# Altium schematic sheet USB.SchDoc
size A4; DocumentNumber: 3; SheetNumber: 3; SheetTotal: 8
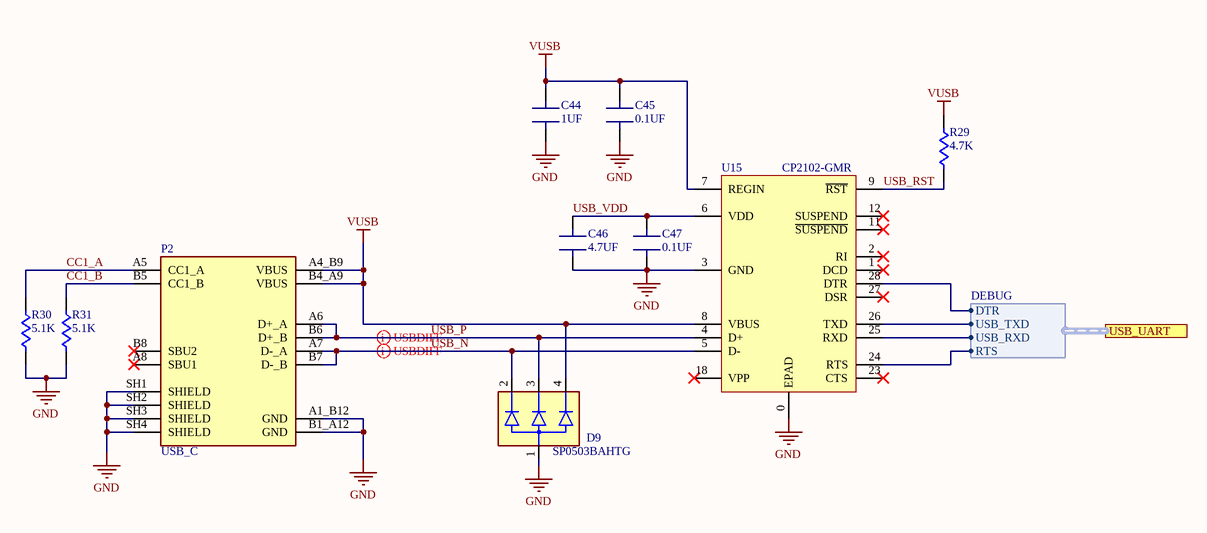
[diagram p0: USB.SchDoc]

## Parts
C44  1UF  [CAP: 0603]
C45  0.1UF  [CAP: 0603]
C46  4.7UF  [CAP: 0805]
C47  0.1UF  [CAP: 0603]
D9  SP0503BAHTG  [SOT143-4]
P2  USB_C  [AMPHENOL_12402012E212A]
R29  4.7K  [RES: 0603]
R30  5.1K  [RES: 0603]
R31  5.1K  [RES: 0603]
U15  CP2102-GMR  [28-QFN (5x5)]

## Ports
USB_UART (harness DEBUG)

## Harnesses
DEBUG: DTR, USB_TXD, USB_RXD, RTS

## Nets
GND: C44.1(A) C45.1(A) C46.1(A) C47.1(A) D9.1 P2.A1_B12(GND) P2.B1_A12(GND) P2.SH1(SHIELD) P2.SH2(SHIELD) P2.SH3(SHIELD) P2.SH4(SHIELD) R30.1 R31.1 U15.0(EPAD) U15.3(GND)
VUSB: C44.2(B) C45.2(B) D9.4 P2.A4_B9(VBUS) P2.B4_A9(VBUS) R29.2 U15.7(REGIN) U15.8(VBUS)
CC1_A: P2.A5(CC1_A) R30.2
CC1_B: P2.B5(CC1_B) R31.2
USB_N: D9.2 P2.A7(D-_A) P2.B7(D-_B) U15.5(D-)
USB_P: D9.3 P2.A6(D+_A) P2.B6(D+_B) U15.4(D+)
USB_RST: R29.1 U15.9(~{RST})
USB_VDD: C46.2(B) C47.2(B) U15.6(VDD)
NetU15_24: U15.24(RTS) ; port USB_UART.RTS
NetU15_25: U15.25(RXD) ; port USB_UART.USB_RXD
NetU15_26: U15.26(TXD) ; port USB_UART.USB_TXD
NetU15_28: U15.28(DTR) ; port USB_UART.DTR

Not connected (* = marked no-connect by the designer): P2 A8(SBU1)* B8(SBU2)*; U15 1(DCD)* 2(RI)* 11(~{SUSPEND})* 12(SUSPEND)* 18(VPP)* 23(CTS)* 27(DSR)*

## Layout directives
differential pair; net class USBDIFF: USB_N, USB_P

## Notes on the sheet
- Size:
- Date:
- Sheet Name:
- A4
- Sheet
- Time:
- of
- Author :
- Hatim Saad
- Project:
- File:

## Library data of the parts
C44 C45 C47 = CAP 0603: CAP SMD 0603
C46 = CAP 0805: CAP SMD 0805
D9 = SP0503BAHTG: SP050xBA Series 8.5 V 30 pF Triple Uni-Directional TVS Avalanche Diode-SOT143-4; Manufacturer: Littelfuse; Operating Supply Voltage: 5.5V; Direction: Unidirectional; Value: 30pF; Number of Channels: 3; Clamping Voltage: 7.8V; Power Line Protection: No; Polarity: Bidirectional,Unidirectional; Max Power Dissipation: 225mW; ESD Protection: Yes; Max Reverse Leakage Current: 100nA; Voltage Rating (DC): 5V; Clamping Voltage-Max: 8V; Supplier: Future Electronics; Supplier Part Number: 4171229; Manufacturer Part Number: SP0503BAHTG; RoHS: Yes; Category: TVS Diodes; Stock: 3237; Pricing: 1=0.85, 15=0.75, 75=0.69, 300=0.64, 1500=0.585 (USD); Mounting Technology: Surface Mount; Case/Package: SOT-143; Pins: 4; Min Operating Temperature: -40°C; Max Operating Temperature: 85°C; Packaging: Tape and Reel; Number of Unidirectional Channels: 3; Reverse Standoff Voltage: 5.5V; Breakdown Voltage: 5.5V; Termination: SMD/SMT; Working Voltage: 5.5V; Peak Pulse Power: 225mW; Leakage Current: 100nA; Number of Elements: 3; Power Dissipation: 225mW; Diode Type: Avalanche; Series: SP05, SPA®; Length: 3.04mm; Width: 1.4mm; Height: 1.05mm; Depth: 1.4mm; Radiation Hardening: No; Reach SVHC Compliant: No; Lead Free: Lead Free; RoHS Compliant: Yes; ComponentLink1URL: https://datasheet.ciiva.com/15143/getdatasheetpartid-116020-15143550.pdf?src-supplier=Verical; ComponentLink1Description: https://datasheet.ciiva.com/15143/getdatasheetpartid-116020-15143550.pdf?src-supplier=Verical; ComponentLink2URL: https://datasheet.ciiva.com/7650/526672-7650894.pdf?src-supplier=Element14; ComponentLink2Description: https://datasheet.ciiva.com/7650/526672-7650894.pdf?src-supplier=Element14; ComponentLink3URL: https://datasheet.ciiva.com/8062/littefuse-spa-sp050x-8062422.pdf?src-supplier=Element14; ComponentLink3Description: https://datasheet.ciiva.com/8062/littefuse-spa-sp050x-8062422.pdf?src-supplier=Element14; ComponentLink4URL: https://datasheet.ciiva.com/22697/1911798-22697942.pdf?src-supplier=Element14; ComponentLink4Description: https://datasheet.ciiva.com/22697/1911798-22697942.pdf?src-supplier=Element14; ComponentLink5URL: https://datasheet.ciiva.com/4509/sp05x-leadfree-4509162.pdf?src-supplier=Mouser; ComponentLink5Description: https://datasheet.ciiva.com/4509/sp05x-leadfree-4509162.pdf?src-supplier=Mouser; ComponentLink6URL: https://datasheet.ciiva.com/332/sp05xxba-332551.pdf?src-supplier=Digi-Key; ComponentLink6Description: https://datasheet.ciiva.com/332/sp05xxba-332551.pdf?src-supplier=Digi-Key; ComponentLink7URL: https://datasheet.ciiva.com/332/sp05xxba-332552.pdf?src-supplier=Digi-Key; ComponentLink7Description: https://datasheet.ciiva.com/332/sp05xxba-332552.pdf?src-supplier=Digi-Key; ComponentLink8URL: https://datasheet.ciiva.com/332/sp05xxba-332550.pdf?src-supplier=Digi-Key; ComponentLink8Description: https://datasheet.ciiva.com/332/sp05xxba-332550.pdf?src-supplier=Digi-Key; ComponentLink9URL: https://datasheet.ciiva.com/16449/sp05xxba-16449463.pdf?src-supplier=Future+Electronics; ComponentLink9Description: https://datasheet.ciiva.com/16449/sp05xxba-16449463.pdf?src-supplier=Future+Electronics; Supplier 1: Mouser; Supplier Part Number 1: 576-SP0503BAHTG
P2 = 12402012E212A: USB Connectors USB2.0, Type C, Top mount, CH 1.68mm, Dual Row SMT; Manufacturer: Amphenol; Supplier: Mouser; Supplier Part Number: 523-12402012E212A; Manufacturer Part Number: 12402012E212A; RoHS: No; Category: Connectors; Stock: 14661; Pricing: 1=0.66, 10=0.523, 50=0.502, 100=0.46, 1000=0.345, 10000=0.293 (USD); Supplier 1: Mouser; Supplier Part Number 1: 523-12402012E212A
R29-R31 = RES 0603: RES SMD 0603
U15 = CP2102-GMR: Interface IC low speed/full speed USB to UART bridge USB 2.0 3.3V, CP2102-GMR, VFQFN-28; Manufacturer: Silicon Labs; Number of Channels: 1; Data Rate: 1000Kbps; Max Supply Voltage: 3.6V; Min Supply Voltage: 3V; Operating Supply Current: 20mA; Supply Current: 26mA; Supplier 1: Mouser; Manufacturer Part Number: CP2102-GMR; RoHS: Yes; Category: Interface ICs; Stock 1: 44709; Pricing 1: 1=9.23, 10=8.41, 50=7.82, 100=6.93, 1000=5.28, 10000=5.16 (USD); Mount: Surface Mount; Case/Package: QFN; Number of Pins: 28; Weight: 0.00239oz; Contact Plating: Tin; Min Operating Temperature: -40°C; Max Operating Temperature: 85°C; Packaging: Tape and Reel; Package Quantity: 1500; Interface: UART; Series: -; Radiation Hardening: No; Lead Free: Lead Free; RoHS Compliant: Yes; ComponentLink1URL: https://datasheet.ciiva.com/6636/cp2102-9-6636566.pdf?src-supplier=Digi-Key; ComponentLink1Description: https://datasheet.ciiva.com/6636/cp2102-9-6636566.pdf?src-supplier=Digi-Key; ComponentLink2URL: https://datasheet.ciiva.com/6636/cp2102-9-6636571.pdf?src-supplier=Digi-Key; ComponentLink2Description: https://datasheet.ciiva.com/6636/cp2102-9-6636571.pdf?src-supplier=Digi-Key; Supplier Part Number 1: 634-CP2102-GMR